# EAGLE design MotorBoard (EAGLE 8.3.1)
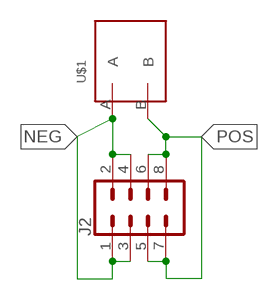
[diagram p0: schematic, sheet 1]

## Parts
J2  CONN_04X2  [2X4]
U$1  MOTOR_ONBOARD  [MOTOR_ONBOARD]

## Nets
NEG: J2.1 J2.2 J2.3 J2.4 U$1.A
POS: J2.5 J2.6 J2.7 J2.8 U$1.B

## Library data of the parts
J2 = SparkFun-Connectors:CONN_04X2: Multi connection point. Often used as Generic Header-pin footprint for 0.1 inch spaced/style header connections On any of the 0.1 inch spaced packages, you can populate with these: Break Away Headers - Straight <https://www.sparkfun.com/products/116> (PRT-00116) Break Away Male Headers - Right Angle <https://www.sparkfun.com/products/553> (PRT-00553) Female Headers <https://www.sparkfun.com/products/115> (PRT-00115) Break Away Headers - Machine Pin <https://www.sparkfun.com/products/117> (PRT-00117) Break Away Female Headers - Swiss Machine Pin <https://www.sparkfun.com/products/743> (PRT-00743)
U$1 = Richard:MOTOR_ONBOARD

## Board
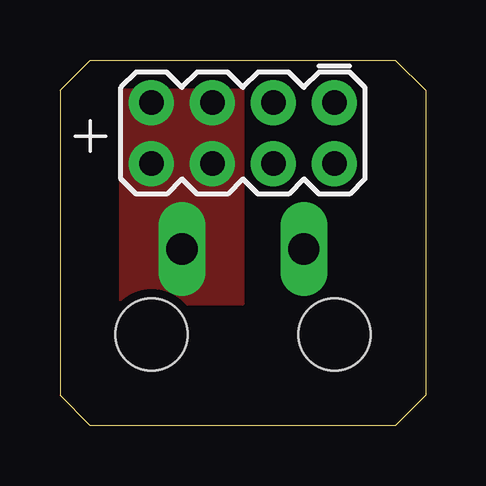
[diagram p1: board, top side]
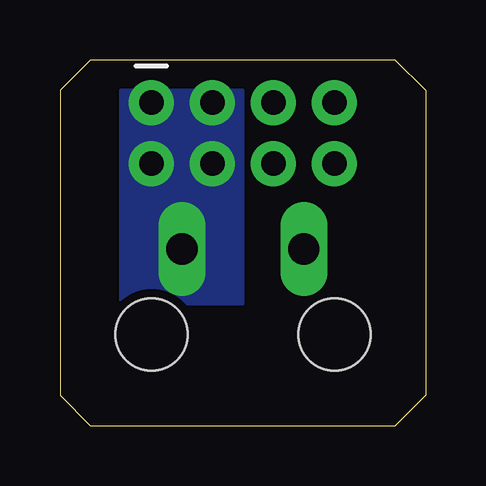
[diagram p2: board, bottom side, seen from below]

Size 15.24 x 15.24 mm. Coordinates in mm from the lower left corner, seen from the top.
Outline: 0,13.97 0,1.27 1.27,0 13.97,0 15.24,1.27 15.24,13.97 13.97,15.24 1.27,15.24 0,13.97
Copper layers (1*16): Top 0.0356mm / dielectric 1.5011mm / Bottom 0.0356mm
Design rules "LaenPCBOrder": minimum track width 6mil, minimum drill 13mil, track to track 6mil, track to pad 6mil, pad to pad 6mil, via to via 6mil, smd to smd 6mil, copper to edge 15mil, drill to drill 6mil, minimum pad ring 7mil, minimum via ring 7mil, stop-mask expansion 3mil, vias tented up to drill 0mil, thermal gap 10mil
Holes 3 mm at 3.81,3.81 11.43,3.81

### Footprints (pad centres in the part's own frame; a part is rotated, then mirrored left to right if it is on the bottom)
2X4 = drill 1.016 pad 1.88: 1 -3.81,-1.27; 2 -3.81,1.27; 3 -1.27,-1.27; 4 -1.27,1.27; 5 1.27,-1.27; 6 1.27,1.27; 7 3.81,-1.27; 8 3.81,1.27
MOTOR_ONBOARD = drill 1.3 long: A -2.54,0; B 2.54,0

### Placement (x,y rotation side)
J2  7.62,12.19 180 top
U$1  7.62,7.37 180 top

### Tracks (layer width: path | path; a pad name or v marks a point on that pad's centre or on a via)
NEG
  pour Bottom (no thermals): 7.62,5.08 12.7,5.08 12.7,13.97 7.62,13.97
POS
  pour Top (no thermals): 2.54,5.08 7.62,5.08 7.62,13.97 2.54,13.97